# Altium project steam_dev_kit.PrjPcb
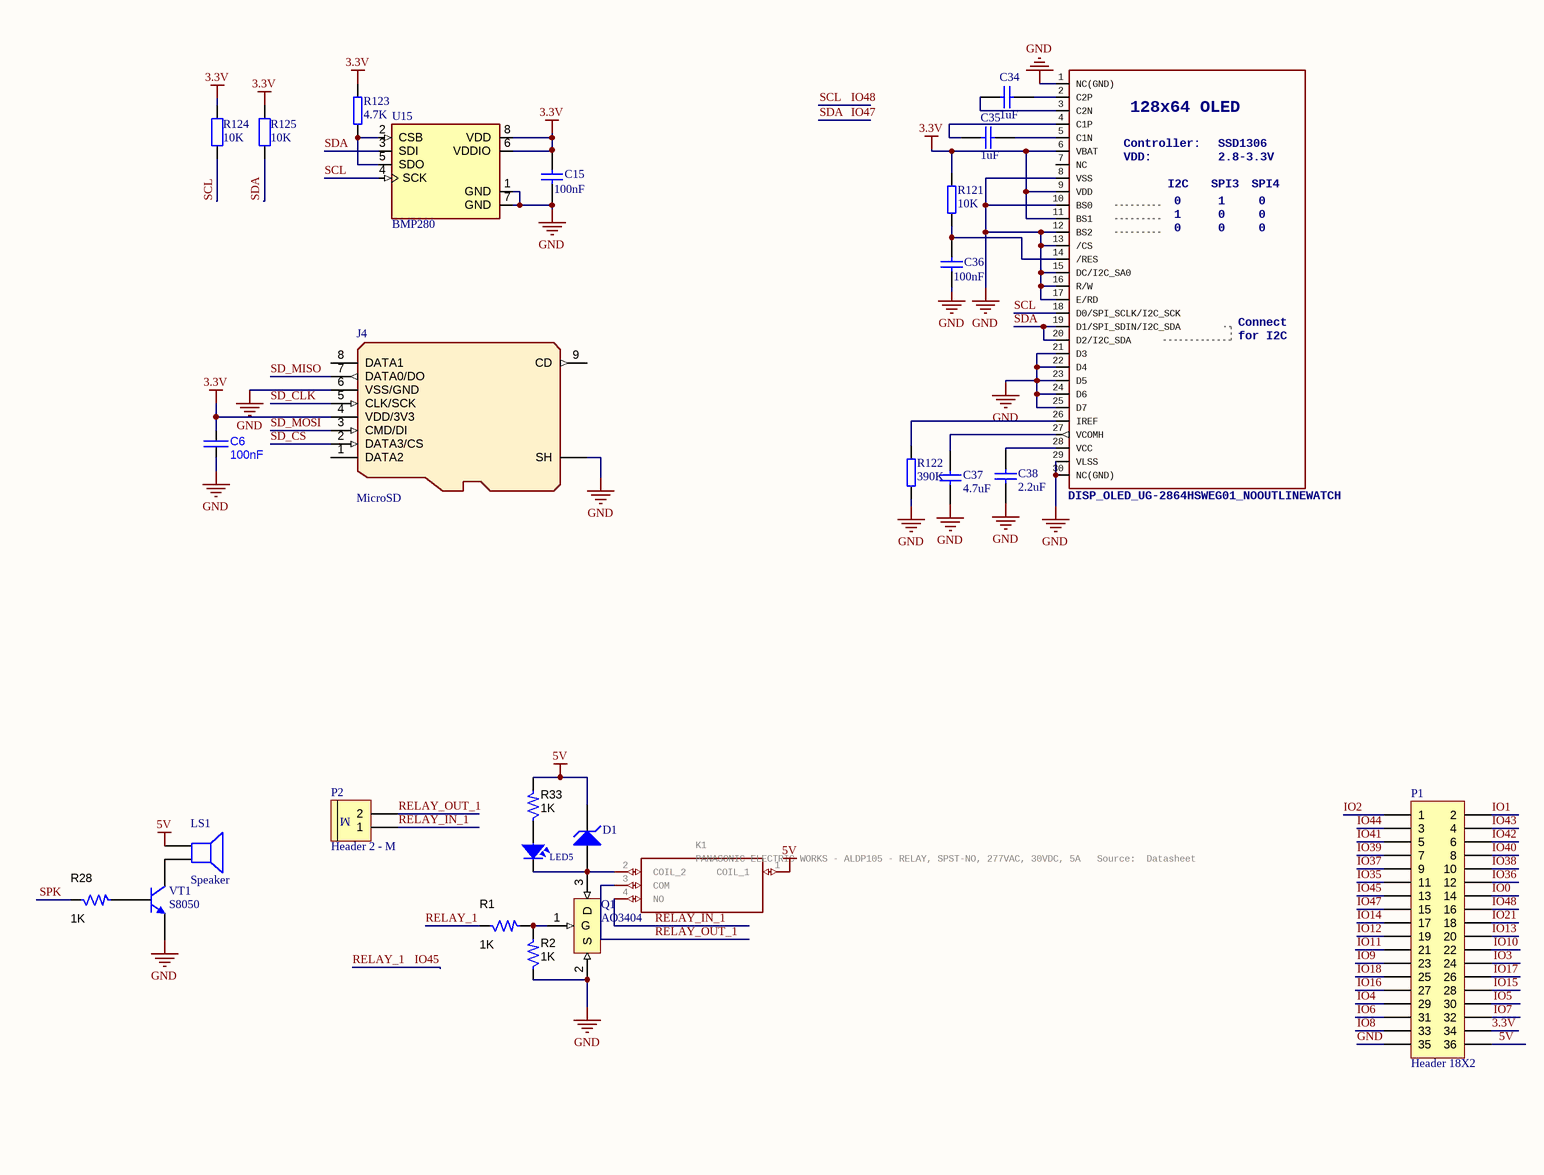
[diagram p0: Other_funtions.SchDoc, left]
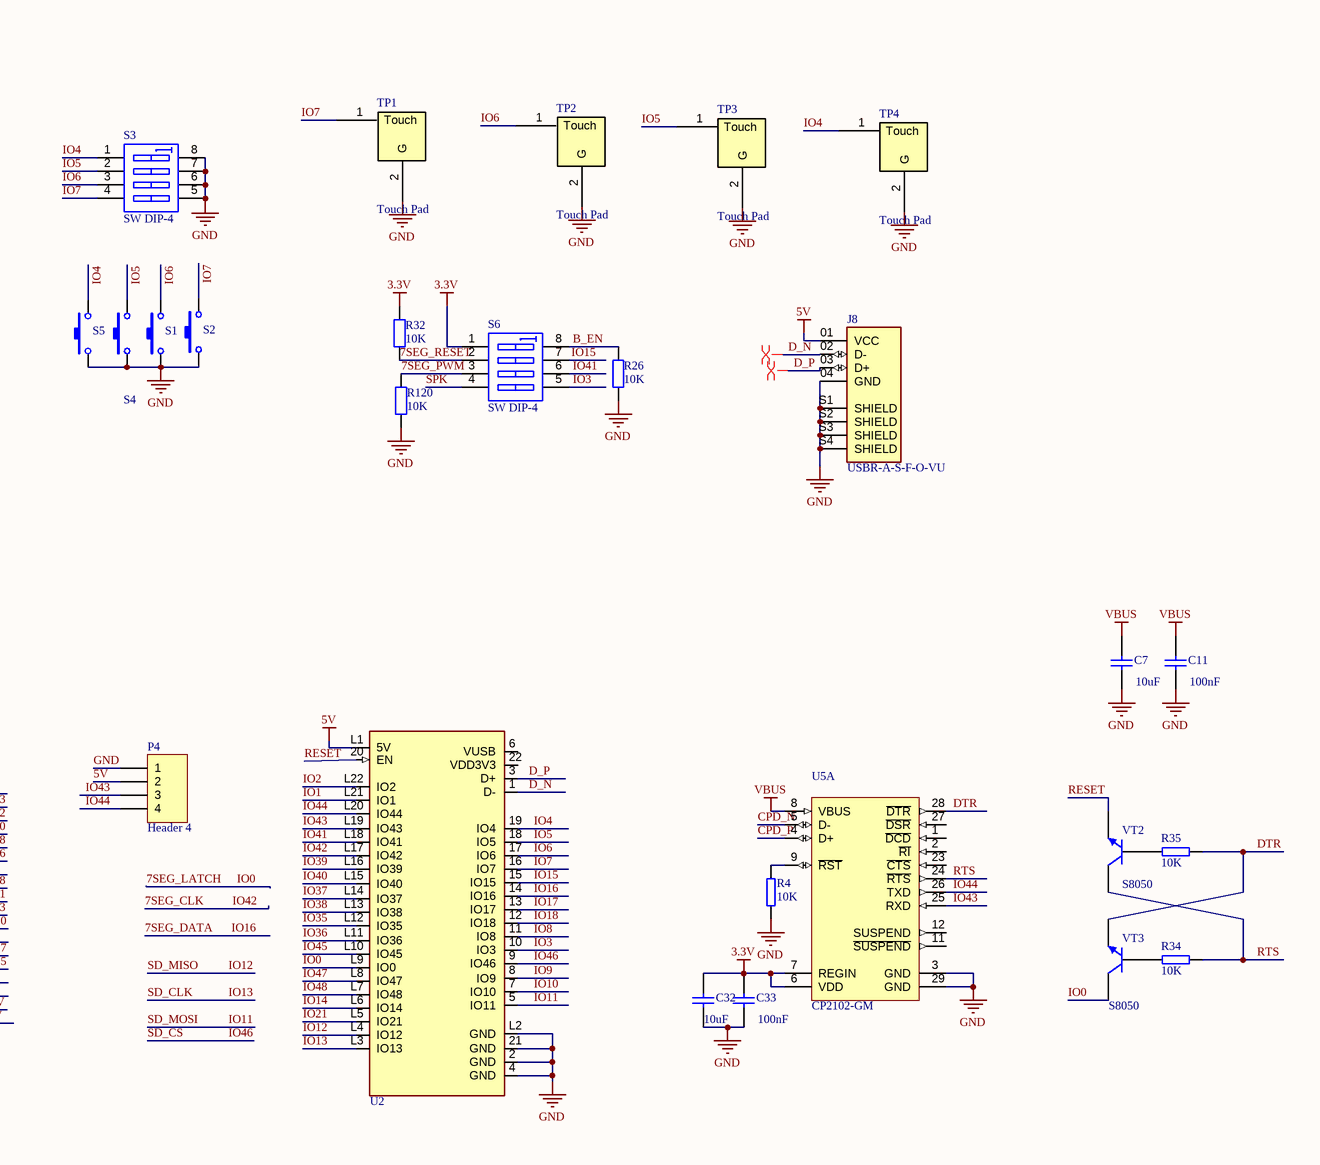
[diagram p1: Other_funtions.SchDoc, right]
5 sheets, 218 parts. Net scope: global (net labels, ports and power ports of the same name join across sheets).
Board file: Steam_dev_kit_revised.PcbDoc
Sheets:
  Other_funtions.SchDoc
  VGA.SchDoc
  ethernet.SchDoc
  POWER_SCH.SchDoc
  LEDS_DISP.SchDoc

## Sheet Other_funtions.SchDoc
size 594 x 420 mm

### Parts
C6  value 100nF  [CAPC2012X135N]  (hidden comment: approved sub OK)
C7  value 10uF  [CAPC1608X90N]  (hidden comment: Cap Semi)
C11  value 100nF  [CAPC1608X90N]  (hidden comment: Cap Semi)
C15  value 100nF  [CAPC1608X90N]  (hidden comment: Cap Semi)
C32  value 10uF  [CAPC1608X90N]  (hidden comment: Cap Semi)
C33  value 100nF  [CAPC1608X90N]  (hidden comment: Cap Semi)
C34  value 1uF  [CAPC1608X90N]  (hidden comment: Cap Semi)
C35  value 1uF  [CAPC1608X90N]  (hidden comment: Cap Semi)
C36  value 100nF  [CAPC1608X90N]  (hidden comment: Cap Semi)
C37  value 4.7uF  [CAPC1608X90N]  (hidden comment: Cap Semi)
C38  value 2.2uF  [CAPC1608X90N]  (hidden comment: Cap Semi)
D1  Diode Zener  [DIODE/NOM/0.5A]  (value not drawn)
J4  MicroSD  [SDCard_Micro]
J8  USBR-A-S-F-O-VU  [SAMTEC_USBR-A-S-F-O-VU]
K1  PANASONIC ELECTRIC WORKS - ALDP105 - RELAY, SPST-NO, 277VAC, 30VDC, 5A   Source:  Datasheet  [ALDP]
LED5  LED SMD  [SM-LED-0805-Orange]  (value not drawn)
LS1  Speaker  [SPEAKER]
OLED1  DISP_OLED_UG-2864HSWEG01_NOOUTLINEWATCH  128x64OLED: 128x64 OLED  forI2C: for I2C  Controller: Controller:  VDD: VDD:  [UG-2864HSWEG01_1.3]
P1  Header 18X2  [HDR2X18]
P2  Header 2 - M  [Medium - Header 2]
P4  Header 4  [HDR1X4]
Q1  AO3404  [SOT23-3]
R1  1K  [RESC1608N_ZERO]
R2  1K  [RESC1608N_ZERO]
R4  value 10K  [RESC1608N_ZERO]  (hidden comment: Resistor)
R26  value 10K  [RES-0603]  (hidden comment: Res2)
R28  1K  [RESC1608N_ZERO]
R32  value 10K  [RES-0603]  (hidden comment: Res2)
R33  1K  [RESC1608N_ZERO]
R34  value 10K  [RESC1608N_ZERO]  (hidden comment: Resistor)
R35  value 10K  [RESC1608N_ZERO]  (hidden comment: Resistor)
R120  value 10K  [RES-0603]  (hidden comment: Res2)
R121  value 10K  [RESC1608N_ZERO]  (hidden comment: Resistor)
R122  value 390K  [RESC1608N_ZERO]  (hidden comment: Resistor)
R123  value 4.7K  [RESC1608N_ZERO]  (hidden comment: Resistor)
R124  value 10K  [RES-0603]  (hidden comment: Res2)
R125  value 10K  [RES-0603]  (hidden comment: Res2)
S1  SW-SMD  [SW-SMD]  (value not drawn)
S2  SW-SMD  [SW-SMD]  (value not drawn)
S3  SW DIP-4  [DIPSWITCH4]
S4  SW-SMD  [SW-SMD]  (value not drawn)
S5  SW-SMD  [SW-SMD]  (value not drawn)
S6  SW DIP-4  [DIPSWITCH4]
TP1  Touch Pad  [Touch Pad]
TP2  Touch Pad  [Touch Pad]
TP3  Touch Pad  [Touch Pad]
TP4  Touch Pad  [Touch Pad]
U2  ESP32S3_CONTROLLER  [ESP32S3_controller]  (value not drawn)
U5  CP2102-GM  [CP2102]  (part A of 2)
U15  BMP280  [XDCR_BMP280]
VT1  S8050  [SMT_TRIODE_NPN]
VT2  S8050  [SMT_TRIODE_NPN]
VT3  S8050  [SMT_TRIODE_NPN]

### Nets
3.3V: C6.2 C15.2 C32.2 C33.2 J4.4(VDD/3V3) OLED1.6(VBAT) OLED1.9(VDD) OLED1.11(BS1) P1.34 R32.1 R121.1 R123.2 R124.1 R125.1 S6.1(A1) U5.6(VDD) U5.7(REGIN) U15.6(VDDIO) U15.8(VDD)
5V: D1.2(K) J8.01(VCC) K1.1(COIL_1) LS1.1 P1.36 P4.2 R33.2 U2.L1(5V)
GND: C6.1 C7.1 C11.1 C15.1 C32.1 C33.1 C36.1 C37.2 C38.2 J4.6(VSS/GND) J4.SH J8.04(GND) J8.S1(SHIELD) J8.S2(SHIELD) J8.S3(SHIELD) J8.S4(SHIELD) OLED1.1(NC(GND)) OLED1.8(VSS) OLED1.10(BS0) OLED1.12(BS2) OLED1.13(/CS) OLED1.15(DC/I2C_SA0) OLED1.16(R/W) OLED1.17(E/RD) OLED1.21(D3) OLED1.22(D4) OLED1.23(D5) OLED1.24(D6) OLED1.25(D7) OLED1.29(VLSS) OLED1.30(NC(GND)) P1.35 P4.1 Q1.2(S) R2.1 R4.2 R26.2 R120.2 R122.2 S1.1 S2.1 S3.5(B4) S3.6(B3) S3.7(B2) S3.8(B1) S4.1 S5.1 TP1.2(G) TP2.2(G) TP3.2(G) TP4.2(G) U2.2(GND) U2.4(GND) U2.21(GND) U2.L2(GND) U5.3(GND) U5.29(GND) U15.1(GND) U15.7(GND) VT1.2(E)
VBUS: C7.2 C11.2 U5.8(VBUS)
7SEG_CLK: P1.6 U2.L17(IO42)  [also labelled IO42]
7SEG_DATA: P1.27 U2.14(IO16)  [also labelled IO16]
7SEG_LATCH: P1.14 U2.L9(IO0) VT3.3(C)  [also labelled IO0]
7SEG_PWM: R120.1 S6.3(A3)
7SEG_RESET: R32.2 S6.2(A2)
B_EN: R26.1 S6.8(B1)
CPD_N: U5.5(D-)
CPD_P: U5.4(D+)
D_N: J8.02(D-) U2.1(D-)
D_P: J8.03(D+) U2.3(D+)
DTR: R35.2 U5.28(~{DTR}) VT3.2(E)
IO1: P1.2 U2.L21(IO1)
IO2: P1.1 U2.L22(IO2)
IO3: P1.24 S6.5(B4) U2.10(IO3)
IO4: P1.29 S3.1(A1) S5.2 TP4.1(Touch) U2.19(IO4)
IO5: P1.30 S3.2(A2) S4.2 TP3.1(Touch) U2.18(IO5)
IO6: P1.31 S1.2 S3.3(A3) TP2.1(Touch) U2.17(IO6)
IO7: P1.32 S2.2 S3.4(A4) TP1.1(Touch) U2.16(IO7)
IO8: P1.33 U2.11(IO8)
IO9: P1.23 U2.8(IO9)
IO10: P1.22 U2.7(IO10)
IO11: J4.3(CMD/DI) P1.21 U2.5(IO11)  [also labelled SD_MOSI]
IO12: J4.7(DATA0/DO) P1.19 U2.L4(IO12)  [also labelled SD_MISO]
IO13: J4.5(CLK/SCK) P1.20 U2.L3(IO13)  [also labelled SD_CLK]
IO14: P1.17 U2.L6(IO14)
IO15: P1.28 S6.7(B2) U2.15(IO15)
IO17: P1.26 U2.13(IO17)
IO18: P1.25 U2.12(IO18)
IO21: P1.18 U2.L5(IO21)
IO35: P1.11 U2.L12(IO35)
IO36: P1.12 U2.L11(IO36)
IO37: P1.9 U2.L14(IO37)
IO38: P1.10 U2.L13(IO38)
IO39: P1.7 U2.L16(IO39)
IO40: P1.8 U2.L15(IO40)
IO41: P1.5 S6.6(B3) U2.L18(IO41)
IO43: P1.4 P4.3 U2.L19(IO43) U5.25(RXD)
IO44: P1.3 P4.4 U2.L20(IO44) U5.26(TXD)
IO45: P1.13 R1.1 U2.L10(IO45)  [also labelled RELAY_1]
IO46: J4.2(DATA3/CS) U2.9(IO46)  [also labelled SD_CS]
IO47: OLED1.19(D1/SPI_SDIN/I2C_SDA) OLED1.20(D2/I2C_SDA) P1.15 R125.2 U2.L8(IO47) U15.3(SDI)  [also labelled SDA]
IO48: OLED1.18(D0/SPI_SCLK/I2C_SCK) P1.16 R124.2 U2.L7(IO48) U15.4(SCK)  [also labelled SCL]
RELAY_IN_1: K1.4(NO) P2.1
RELAY_OUT_1: K1.3(COM) P2.2
RESET: U2.20(EN) VT2.2(E)
RTS: R34.1 U5.24(~{RTS}) VT2.3(C)
SPK: R28.1 S6.4(A4)
NetC34_1: C34.1 OLED1.2(C2P)
NetC34_2: C34.2 OLED1.3(C2N)
NetC35_1: C35.1 OLED1.5(C1N)
NetC35_2: C35.2 OLED1.4(C1P)
NetC36_2: C36.2 OLED1.14(/RES) R121.2
NetC37_1: C37.1 OLED1.27(VCOMH)
NetC38_1: C38.1 OLED1.28(VCC)
NetD1_1: D1.1(A) K1.2(COIL_2) LED5.2 Q1.3(D)
NetLED5_1: LED5.1 R33.1
NetLS1_2: LS1.2 VT1.3(C)
NetOLED1_26: OLED1.26(IREF) R122.1
NetQ1_1: Q1.1(G) R1.2 R2.2
NetR4_1: R4.1 U5.9(~{RST})
NetR28_2: R28.2 VT1.1(B)
NetR34_2: R34.2 VT3.1(B)
NetR35_1: R35.1 VT2.1(B)
NetR123_1: R123.1 U15.2(CSB) U15.5(SDO)

Not connected (* = marked no-connect by the designer): J4 1(DATA2) 8(DATA1) 9(CD); OLED1 7(NC); U2 6(VUSB) 22(VDD3V3); U5 1(~{DCD}) 2(~{RI}) 11(~{SUSPEND}) 12(SUSPEND) 23(~{CTS}) 27(~{DSR})

### Layout directives
differential pair: D_N, D_P

### Notes on the sheet
- DWG NO:
- REV:
- THIS DOCUMENT AND THE DATA DISCLOSED HEREIN OR
- HEREWITH IS THE PROPERTY OF ALTIUM LIMITED AND MAY
- BE FREELY DISTRIBUTED IN WHOLE. NO RIGHTS ARE
- RESERVED OR EXPRESS OR IMPLIED WARANTEE GIVEN.
- REVISION
- DESCRIPTION
- DATE
- APPROVED
- ENG:
- APPROVALS
- PROJECT
- DSN:
- CHK:
- REFERENCE DOCUMENTS
- PROJECT REVISION:
- TITLE
- DOCUMENT REVISION:
- DESIGN ITEM:
- BOM:
- FAB DWG:
- PCB DWG:
- ASSY DWG:
- SCALE:
- A2
- SIZE
- CAGE CODE
- FILE NAME
- DWG NO.
- SHEET
- OF
- REV
- (in symbol Header 2 - M) M

### Library data of the parts
C6 = CAP C_0805: Capacitor SMD Cer 1.8nF 10% 50V X7R 0805; Manufacturer 1: AVX Corporation; Manufacturer Part Number 1: 08055C182KAT2A; Ratings: 50V; X7R; SCDType: source*; Tolerance: ±10%; Operating Temperature: -55°C ~ 125°C; Package / Case: 0805 (2012 metric); Supplier 1: Digi-Key; Supplier Part Number 1: 478-1374-1-ND
C7 C32 = CAP-SM-0603-X5R-10uF: CAP SM 0603 X5R 10uF 10%; Tolerance: ±10%; Supplier 1: Farnell; Supplier 2: Digi-Key; Supplier Part Number 1: 2366833; Supplier Part Number 2: 490-3896-1-ND
C11 C15 C33-C38 = CAP-SM-0603-X7R-100nF: CAP SM 0603 X7R 100nF 10%; Tolerance: ±10%; Supplier 1: Digi-Key; Supplier 2: Farnell; Supplier Part Number 1: 490-3167-1-ND; Supplier Part Number 2: 1775994RL
D1 = Diode Zener: Zener Diode; Published: 8-Jun-2000; LatestRevisionDate: 17-Jul-2002; LatestRevisionNote: Re-released for DXP Platform.; PackageReference: DIODE-0.7; Publisher: Altium Limited
J4 = MicroSD: Micro SD Memory Card Connector; Value: MicroSD
J8 = USBR-A-S-F-O-VU: USB-A (USB TYPE-A) USB 2.0 Receptacle Connector 4 Position Through Hole; MF: Samtec; SnapEDA_Link: https://www.snapeda.com/parts/USBR-A-S-F-O-VU/Samtec+Inc./view-part/?ref=snap; Package: None; Value: *; MP: USBR-A-S-F-O-VU; Check_prices: https://www.snapeda.com/parts/USBR-A-S-F-O-VU/Samtec+Inc./view-part/?ref=eda
K1 = ALDP105: GateName_1: G$1; SymbolName_1: ALDP105; LibraryName: ALDP105; DeviceSetName: ALDP105; Package: ALDP; Manufacturer_Name: Panasonic; Manufacturer_Part_Number: ALDP105; Mouser_Part_Number: 769-ALDP105; Mouser_Price-Stock: https://www.mouser.co.uk/ProductDetail/Panasonic-Industrial-Devices/ALDP105?qs=Xhpf1s68vbq5B68QcwMLFg%3D%3D; Arrow_Part_Number: ALDP105; Arrow_Price-Stock: https://www.arrow.com/en/products/aldp105/panasonic; Height: mm
LED5 = LED SMD 0805
LS1 = Speaker: Loudspeaker; Published: 24-Mar-1999; LatestRevisionDate: 17-Jul-2002; LatestRevisionNote: Re-released for DXP Platform.; PackageReference: PIN2; Publisher: Altium Limited
P1 = Header 18X2: Header, 18-Pin, Dual row; LatestRevisionDate: 17-Jul-2002; LatestRevisionNote: Re-released for DXP Platform.; Publisher: Altium Limited
P2 = Header 2 - M: Header, 2-Pin, Medium; LatestRevisionDate: 17-Jul-2002; LatestRevisionNote: Re-released for DXP Platform.; Publisher: Altium Limited
P4 = Header 4: Header, 4-Pin; LatestRevisionDate: 17-Jul-2002; LatestRevisionNote: Re-released for DXP Platform.; Publisher: Altium Limited
R1 R2 R28 R33 = RES_0603: Resistor SMD chip 0.0 Ohm 0.1W 0603; Manufacturer 1: Vishay/Dale; Manufacturer Part Number 1: CRCW06030000Z0EA; Tolerance: ±5%; Ratings: 1/10W; SCDType: spec; Package / Case: 0603 (1608metric); Supplier 1: Digi-Key; Supplier Part Number 1: 541-0.0GCT-ND; ComponentLink1URL: http://www.vishay.com/doc?20035; ComponentLink1Description: http://www.vishay.com/doc?20035; Supplier 2: Digi-Key; Supplier Part Number 2: P0.0GTR-ND; Manufacturer 2: Panasonic Electronic Components; Manufacturer Part Number 2: ERJ-3GEY0R00V; RoHS 2: RoHS Compliant; ComponentLink2URL: http://industrial.panasonic.com/www-cgi/jvcr13pz.cgi?E+PZ+3+AOA0001+ERJ3GEY0R00V+7+WW; ComponentLink2Description: http://industrial.panasonic.com/www-cgi/jvcr13pz.cgi?E+PZ+3+AOA0001+ERJ3GEY0R00V+7+WW; Supplier 3: Digi-Key; Supplier Part Number 3: 311-0.0LECT-ND; Manufacturer 3: Yageo; Manufacturer Part Number 3: AC0603JR-070RL; RoHS 3: RoHS Compliant; ComponentLink3URL: http://www.yageo.com/documents/recent/PYu-AC_51_RoHS_L_2.pdf; ComponentLink3Description: http://www.yageo.com/documents/recent/PYu-AC_51_RoHS_L_2.pdf
R4 R34 R35 R121-R123 = RES-SM-0603-10K: RES SM 0603 10K; Supplier 1: Farnell; Supplier 2: Digi-Key; Supplier Part Number 1: 9330399; Supplier Part Number 2: 541-10.0KHCT-ND
R26 R32 R120 R124 R125 = Res2: Resistor; Published: 8-Jun-2000; LatestRevisionDate: 17-Jul-2002; LatestRevisionNote: Re-released for DXP Platform.; PackageReference: AXIAL-0.4; Publisher: Altium Limited; PackageDescription: Axial Device, Thru-Hole; 2 Leads; 0.4 in Pin Spacing
S1 S2 S4 S5 = SW-SMD: Switch; Published: 24-Mar-1999; LatestRevisionDate: 17-Jul-2002; LatestRevisionNote: Re-released for DXP Platform.; PackageReference: SPST-2; Publisher: Altium Limited
S3 S6 = SW DIP-4: DIP Switch, 4 Position, SPST; Published: 24-Mar-1999; LatestRevisionDate: 29-May-2009; LatestRevisionNote: IPC-7351 Footprint Added.; PackageVersion: Dec-2002; PackageReference: SO8; Publisher: Altium Limited; PackageDescription: 8-Pin Small Outline Integrated Circuit 1.27 mm Pitch; Code_JEDEC: MS-012-AA; Code_IPC: SOIC127P600-8
U5 = CP2102-GM: Single-Chip USB to UART Bridge, 1024 Bytes EEPROM, -40 to 85 degC, 28-pin QFN, Tube; Manufacturer: Silicon Labs; Internal Oscillator: TRUE; Sub-Family: USB Bridges; DatasheetVersion: Rev. 1.5; PackageReference: QFN-28; PackageDescription: 28-Pin Quad-Flat No-Leads Package, Body 5 x 5 mm, Pitch 0.5 mm; Supplier 1: Digi-Key; Supplier Part Number 1: 336-1160-5-ND; Supplier 2: Farnell; Supplier Part Number 2: 9282130; Supplier 3: Newark; Supplier Part Number 3: 30K5635; Supplier 4: Mouser; Supplier Part Number 4: 634-CP2102-GM; EEPROM: 1024 Bytes; Mounting Technology: Surface Mount; Code_JEDEC: MO-220; Code_IPC: J-STD-020C; PartNumber: CP2102-GM; ComponentLink1Description: Manufacturer URL; ComponentLink1URL: http://www.silabs.com/; ComponentLink2Description: Datasheet; ComponentLink2URL: http://www.silabs.com/Support%20Documents/TechnicalDocs/CP2102-9.pdf; ComponentLink3Description: Package Specification; ComponentLink3URL: http://www.silabs.com/Support%20Documents/TechnicalDocs/C8051T61x.pdf
U15 = BMP280: BMP280 Absolute Barometric Pressure Sensor for Battery Powered Devices 2 x 2.5mm; Package: None; Availability: Unavailable; MP: BMP280; Value: *; Price: None
VT1-VT3 = SMT_TRIODE_NPN: Surface mount NPN transistor, package SOT-23
OLED1 = DISP_OLED_UG-2864HSWEG01_NOOUTLINEWATCH: I2C: I2C; SPI3: SPI3; 0: 0; 1: 1; Connect: Connect; SSD1306: SSD1306; 2.8-3.3V: 2.8-3.3V; SPI4: SPI4

## Sheet VGA.SchDoc
size 431 x 279 mm
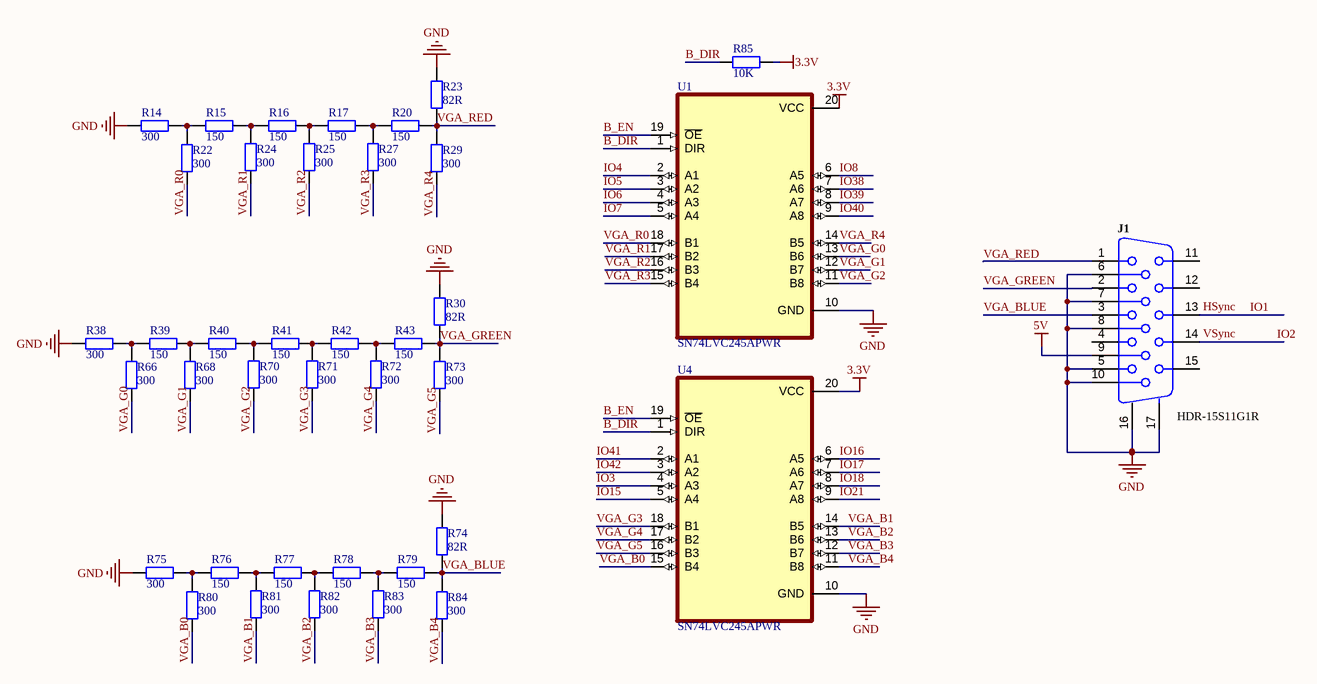
[diagram p2: VGA.SchDoc]

### Parts
J1  HDR-15S11G1R  [DB15-VGA-Female]
R14  value 300  [RES-0603]  (hidden comment: Res2)
R15  value 150  [RES-0603]  (hidden comment: Res2)
R16  value 150  [RES-0603]  (hidden comment: Res2)
R17  value 150  [RES-0603]  (hidden comment: Res2)
R20  value 150  [RES-0603]  (hidden comment: Res2)
R22  value 300  [RES-0603]  (hidden comment: Res2)
R23  value 82R  [RES-0603]  (hidden comment: Res2)
R24  value 300  [RES-0603]  (hidden comment: Res2)
R25  value 300  [RES-0603]  (hidden comment: Res2)
R27  value 300  [RES-0603]  (hidden comment: Res2)
R29  value 300  [RES-0603]  (hidden comment: Res2)
R30  value 82R  [RES-0603]  (hidden comment: Res2)
R38  value 300  [RES-0603]  (hidden comment: Res2)
R39  value 150  [RES-0603]  (hidden comment: Res2)
R40  value 150  [RES-0603]  (hidden comment: Res2)
R41  value 150  [RES-0603]  (hidden comment: Res2)
R42  value 150  [RES-0603]  (hidden comment: Res2)
R43  value 150  [RES-0603]  (hidden comment: Res2)
R66  value 300  [RES-0603]  (hidden comment: Res2)
R68  value 300  [RES-0603]  (hidden comment: Res2)
R70  value 300  [RES-0603]  (hidden comment: Res2)
R71  value 300  [RES-0603]  (hidden comment: Res2)
R72  value 300  [RES-0603]  (hidden comment: Res2)
R73  value 300  [RES-0603]  (hidden comment: Res2)
R74  value 82R  [RES-0603]  (hidden comment: Res2)
R75  value 300  [RES-0603]  (hidden comment: Res2)
R76  value 150  [RES-0603]  (hidden comment: Res2)
R77  value 150  [RES-0603]  (hidden comment: Res2)
R78  value 150  [RES-0603]  (hidden comment: Res2)
R79  value 150  [RES-0603]  (hidden comment: Res2)
R80  value 300  [RES-0603]  (hidden comment: Res2)
R81  value 300  [RES-0603]  (hidden comment: Res2)
R82  value 300  [RES-0603]  (hidden comment: Res2)
R83  value 300  [RES-0603]  (hidden comment: Res2)
R84  value 300  [RES-0603]  (hidden comment: Res2)
R85  value 10K  [RES-0603]  (hidden comment: Res2)
U1  SN74LVC245APWR  [SOP65P640X120-20N]
U4  SN74LVC245APWR  [SOP65P640X120-20N]

### Nets
3.3V: R85.1 U1.20(VCC) U4.20(VCC)
5V: J1.9
GND: J1.5 J1.6 J1.7 J1.8 J1.10 J1.16(MH1) J1.17(MH2) R14.2 R23.2 R30.2 R38.2 R74.2 R75.2 U1.10(GND) U4.10(GND)
B_DIR: R85.2 U1.1(DIR) U4.1(DIR)
B_EN: U1.19(~{OE}) U4.19(~{OE})
IO1: J1.13
IO2: J1.14
IO3: U4.4(A3)
IO4: U1.2(A1)
IO5: U1.3(A2)
IO6: U1.4(A3)
IO7: U1.5(A4)
IO8: U1.6(A5)
IO15: U4.5(A4)
IO16: U4.6(A5)  [project net 7SEG_DATA]
IO17: U4.7(A6)
IO18: U4.8(A7)
IO21: U4.9(A8)
IO38: U1.7(A6)
IO39: U1.8(A7)
IO40: U1.9(A8)
IO41: U4.2(A1)
IO42: U4.3(A2)  [project net 7SEG_CLK]
VGA_B0: R80.2 U4.15(B4)
VGA_B1: R81.2 U4.14(B5)
VGA_B2: R82.2 U4.13(B6)
VGA_B3: R83.2 U4.12(B7)
VGA_B4: R84.2 U4.11(B8)
VGA_BLUE: J1.3 R74.1 R79.1 R84.1
VGA_G0: R66.2 U1.13(B6)
VGA_G1: R68.2 U1.12(B7)
VGA_G2: R70.2 U1.11(B8)
VGA_G3: R71.2 U4.18(B1)
VGA_G4: R72.2 U4.17(B2)
VGA_G5: R73.2 U4.16(B3)
VGA_GREEN: J1.2 R30.1 R43.1 R73.1
VGA_R0: R22.2 U1.18(B1)
VGA_R1: R24.2 U1.17(B2)
VGA_R2: R25.2 U1.16(B3)
VGA_R3: R27.2 U1.15(B4)
VGA_R4: R29.2 U1.14(B5)
VGA_RED: J1.1 R20.1 R23.1 R29.1
NetR14_1: R14.1 R15.2 R22.1
NetR15_1: R15.1 R16.2 R24.1
NetR16_1: R16.1 R17.2 R25.1
NetR17_1: R17.1 R20.2 R27.1
NetR38_1: R38.1 R39.2 R66.1
NetR39_1: R39.1 R40.2 R68.1
NetR40_1: R40.1 R41.2 R70.1
NetR41_1: R41.1 R42.2 R71.1
NetR42_1: R42.1 R43.2 R72.1
NetR75_1: R75.1 R76.2 R80.1
NetR76_1: R76.1 R77.2 R81.1
NetR77_1: R77.1 R78.2 R82.1
NetR78_1: R78.1 R79.2 R83.1

Not connected (* = marked no-connect by the designer): J1 4 11 12 15

### Notes on the sheet
- Labels drawn without touching a wire or pin: HSync, VSync
- DWG. NO.
- REV.
- SHT.
- THIS DOCUMENT AND THE DATA DISCLOSED HEREIN OR HEREWITH IS THE PROPERTY OF ALTIUM LIMITED AND MAY BE FREELY DISTRIBUTED IN WHOLE. NO RIGHTS ARE RESERVED OR EXPRESS OR IMPLIED WARANTEE GIVEN.
- REVISION
- DESCRIPTION
- DATE
- APPROVED
- ENG:
- APPROVALS
- PROJECT
- DSN:
- CHK:
- REFERENCE DOCUMENTS
- PROJECT REVISION:
- TITLE
- DOCUMENT REVISION:
- DESIGN ITEM:
- BOM:
- FAB DWG:
- PCB DWG:
- ASSY DWG:
- SCALE:
- SIZE
- B
- CAGE CODE
- FILE NAME
- DWG NO.
- SHEET
- OF
- REV

### Library data of the parts
J1 = CON 15 Female: Socket, High-Density DB15 (HD15) R/A Female Through-hole; Connector type: Right Angle; Max Current: 3 A; Category: Connector; Mounting Technology: Through-Hole; Pin Count: 15; Status: Unreleased
R14-R17 R20 R22-R25 R27 R29 R30 R38-R43 R66 R68 R70-R85 = Res2: Resistor; Published: 8-Jun-2000; LatestRevisionDate: 17-Jul-2002; LatestRevisionNote: Re-released for DXP Platform.; PackageReference: AXIAL-0.4; Publisher: Altium Limited; PackageDescription: Axial Device, Thru-Hole; 2 Leads; 0.4 in Pin Spacing
U1 U4 = SN74LVC245APWR: Octal Bus Transceiver With 3-State Outputs 20-TSSOP -40 to 125; MF: Texas Instruments; Check_prices: https://www.snapeda.com/parts/SN74LVC245APWR/Texas%20Instruments/view-part/213920/?ref=eda; Package: TSSOP-20 Texas Instruments; MP: SN74LVC245APWR; Purchase-URL: https://pricing.snapeda.com/search/part/SN74LVC245APWR/?ref=eda; SnapEDA_Link: https://www.snapeda.com/parts/SN74LVC245APWR/Texas%20Instruments/view-part/213920/?ref=snap; Value: *; Price: None; Availability: Good

## Sheet ethernet.SchDoc
size 431 x 279 mm
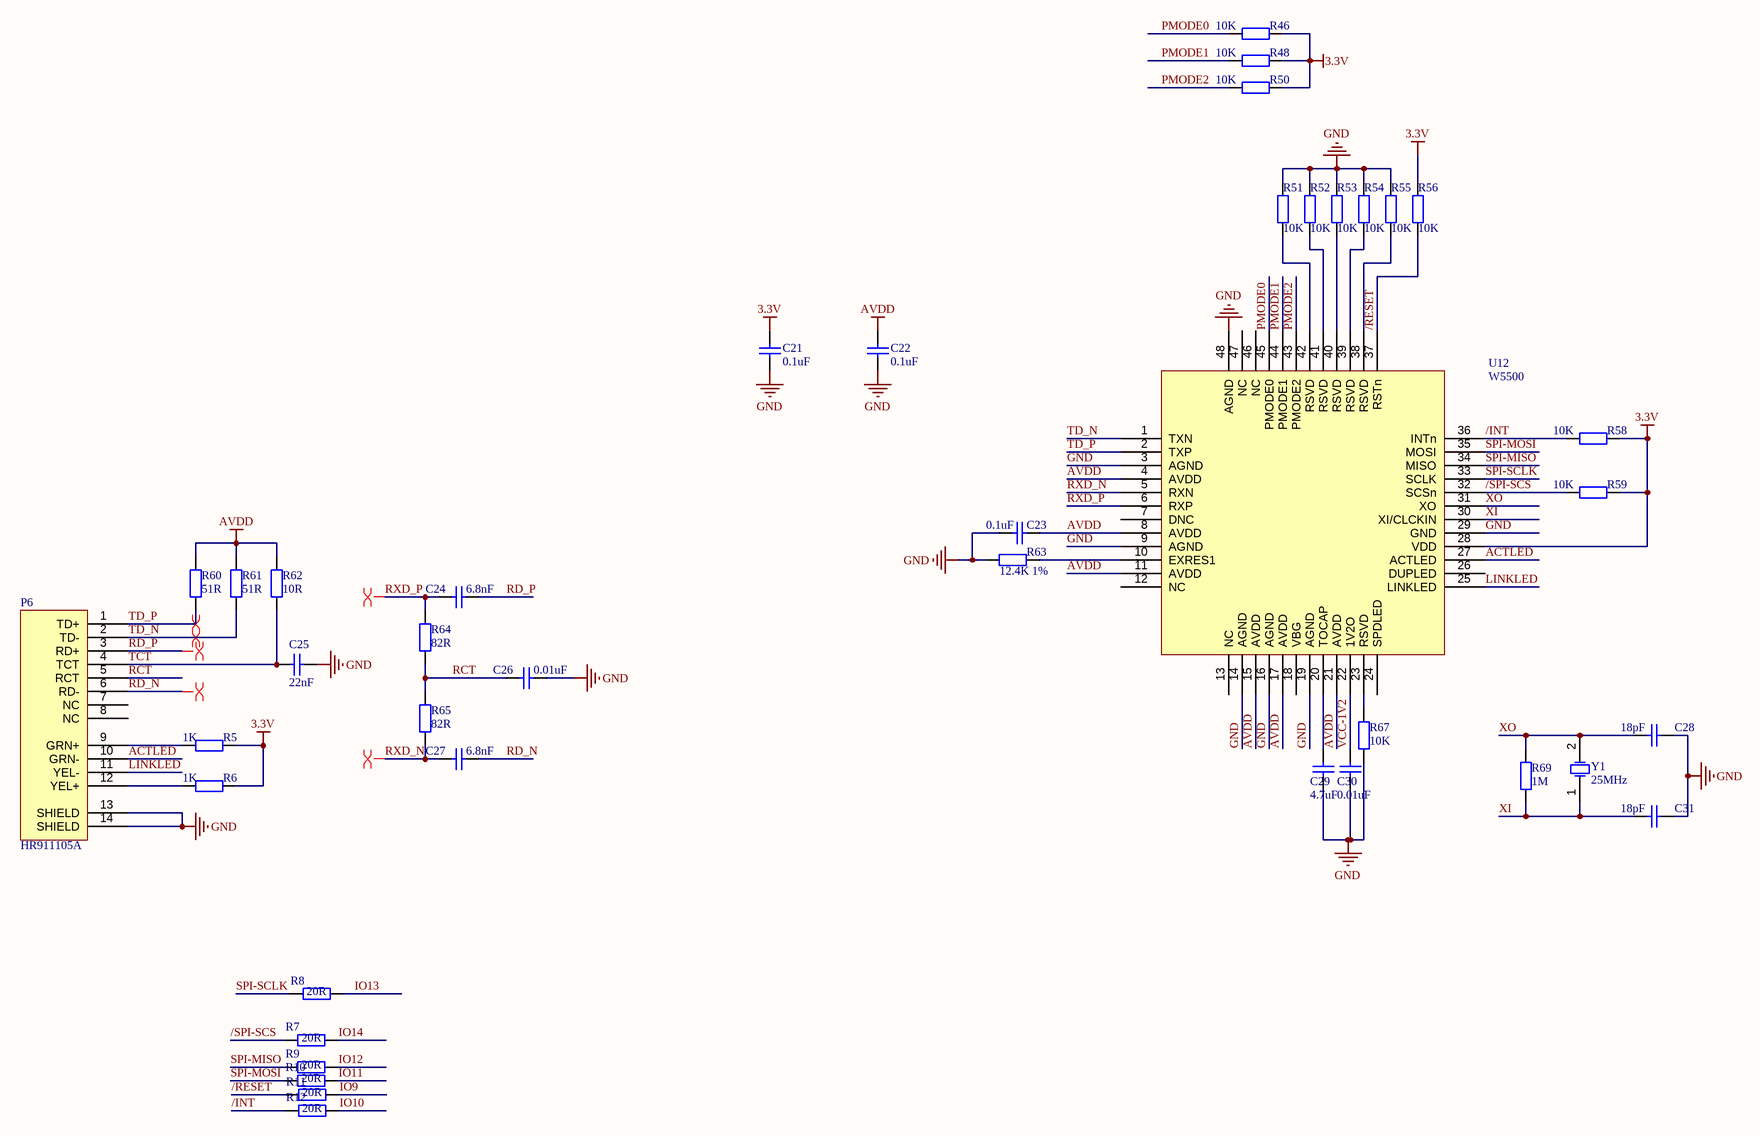
[diagram p3: ethernet.SchDoc]

### Parts
C21  value 0.1uF  [C0805]  (hidden comment: Cap)
C22  value 0.1uF  [C0805]  (hidden comment: Cap)
C23  value 0.1uF  [C0805]  (hidden comment: Cap)
C24  value 6.8nF  [C0805]  (hidden comment: Cap)
C25  value 22nF  [C0805]  (hidden comment: Cap)
C26  value 0.01uF  [C0805]  (hidden comment: Cap)
C27  value 6.8nF  [C0805]  (hidden comment: Cap)
C28  value 18pF  [C0805]  (hidden comment: Cap)
C29  value 4.7uF  [C0805]  (hidden comment: Cap)
C30  value 0.01uF  [C0805]  (hidden comment: Cap)
C31  value 18pF  [C0805]  (hidden comment: Cap)
P6  HR911105A  [HR911105A]
R5  value 1K  [C0805]  (hidden comment: Res2)
R6  value 1K  [C0805]  (hidden comment: Res2)
R7  value 20R  [C0805]  (hidden comment: Res2)
R8  value 20R  [C0805]  (hidden comment: Res2)
R9  value 20R  [C0805]  (hidden comment: Res2)
R10  value 20R  [C0805]  (hidden comment: Res2)
R11  value 20R  [C0805]  (hidden comment: Res2)
R12  value 20R  [C0805]  (hidden comment: Res2)
R46  value 10K  [C0805]  (hidden comment: Res2)
R48  value 10K  [C0805]  (hidden comment: Res2)
R50  value 10K  [C0805]  (hidden comment: Res2)
R51  value 10K  [C0805]  (hidden comment: Res2)
R52  value 10K  [C0805]  (hidden comment: Res2)
R53  value 10K  [C0805]  (hidden comment: Res2)
R54  value 10K  [C0805]  (hidden comment: Res2)
R55  value 10K  [C0805]  (hidden comment: Res2)
R56  value 10K  [C0805]  (hidden comment: Res2)
R58  value 10K  [C0805]  (hidden comment: Res2)
R59  value 10K  [C0805]  (hidden comment: Res2)
R60  value 51R  [C0805]  (hidden comment: Res2)
R61  value 51R  [C0805]  (hidden comment: Res2)
R62  value 10R  [C0805]  (hidden comment: Res2)
R63  value 12.4K 1%  [C0805]  (hidden comment: Res2)
R64  value 82R  [C0805]  (hidden comment: Res2)
R65  value 82R  [C0805]  (hidden comment: Res2)
R67  value 10K  [C0805]  (hidden comment: Res2)
R69  value 1M  [C0805]  (hidden comment: Res2)
U12  W5500  [LQFP48]
Y1  25MHz  [XTAL-HC49]

### Nets
3.3V: C21.1 R5.1 R6.1 R46.2 R48.2 R50.2 R56.2 R58.2 R59.2 U12.28(VDD)
AVDD: C22.2 C23.1 R60.1 R61.1 R62.1 U12.4(AVDD) U12.8(AVDD) U12.11(AVDD) U12.15(AVDD) U12.17(AVDD) U12.21(AVDD)
GND: C21.2 C22.1 C23.2 C25.2 C26.1 C28.1 C29.2 C30.2 C31.1 P6.13(SHIELD) P6.14(SHIELD) R51.2 R52.2 R53.2 R54.2 R55.2 R63.1 R67.1 U12.3(AGND) U12.9(AGND) U12.14(AGND) U12.16(AGND) U12.19(AGND) U12.29(GND) U12.48(AGND)
/INT: R12.2 R58.1 U12.36(INTn)
/RESET: R11.2 R56.1 U12.37(RSTn)
/SPI-SCS: R7.2 R59.1 U12.32(SCSn)
ACTLED: P6.10(GRN-) U12.27(ACTLED)
IO9: R11.1
IO10: R12.1
IO11: R10.1
IO12: R9.1
IO13: R8.1
IO14: R7.1
LINKLED: P6.11(YEL-) U12.25(LINKLED)
PMODE0: R46.1 U12.45(PMODE0)
PMODE1: R48.1 U12.44(PMODE1)
PMODE2: R50.1 U12.43(PMODE2)
RCT: C26.2 P6.5(RCT) R64.1 R65.2
RD_N: C27.1 P6.6(RD-)
RD_P: C24.1 P6.3(RD+)
RXD_N: C27.2 R65.1 U12.5(RXN)
RXD_P: C24.2 R64.2 U12.6(RXP)
SPI-MISO: R9.2 U12.34(MISO)
SPI-MOSI: R10.2 U12.35(MOSI)
SPI-SCLK: R8.2 U12.33(SCLK)
TCT: C25.1 P6.4(TCT) R62.2
TD_N: P6.2(TD-) R61.2 U12.1(TXN)
TD_P: P6.1(TD+) R60.2 U12.2(TXP)
VCC-1V2: C30.1 U12.22(1V2O)
XI: C31.2 R69.1 U12.30(XI/CLCKIN) Y1.1(OSC1)
XO: C28.2 R69.2 U12.31(XO) Y1.2(OSC2)
NetC29_1: C29.1 U12.20(TOCAP)
NetP6_9: P6.9(GRN+) R5.2
NetP6_12: P6.12(YEL+) R6.2
NetR51_1: R51.1 U12.42(RSVD)
NetR52_1: R52.1 U12.41(RSVD)
NetR53_1: R53.1 U12.40(RSVD)
NetR54_1: R54.1 U12.39(RSVD)
NetR55_1: R55.1 U12.38(RSVD)
NetR63_2: R63.2 U12.10(EXRES1)
NetR67_2: R67.2 U12.23(RSVD)

Not connected (* = marked no-connect by the designer): P6 7(NC) 8(NC); U12 7(DNC) 12(NC) 13(NC) 18(VBG) 24(SPDLED) 26(DUPLED) 46(NC) 47(NC)

### Layout directives
differential pair: RD_N, RD_P, RXD_N, RXD_P, TD_N, TD_P

### Notes on the sheet
- DWG. NO.
- REV.
- SHT.
- THIS DOCUMENT AND THE DATA DISCLOSED HEREIN OR HEREWITH IS THE PROPERTY OF ALTIUM LIMITED AND MAY BE FREELY DISTRIBUTED IN WHOLE. NO RIGHTS ARE RESERVED OR EXPRESS OR IMPLIED WARANTEE GIVEN.
- REVISION
- DESCRIPTION
- DATE
- APPROVED
- ENG:
- APPROVALS
- PROJECT
- DSN:
- CHK:
- REFERENCE DOCUMENTS
- PROJECT REVISION:
- TITLE
- DOCUMENT REVISION:
- DESIGN ITEM:
- BOM:
- FAB DWG:
- PCB DWG:
- ASSY DWG:
- SCALE:
- SIZE
- B
- CAGE CODE
- FILE NAME
- DWG NO.
- SHEET
- OF
- REV

### Library data of the parts
C21-C31 = Cap: Capacitor; Published: 8-Jun-2000; LatestRevisionDate: 17-Jul-2002; LatestRevisionNote: Re-released for DXP Platform.; PackageReference: RAD-0.3; Publisher: Altium Limited; PackageDescription: Radial Cap, Thru-Hole; 2 Leads; 0.3 in Pin Spacing
P6 = HR911105A: RJ45插座
R5-R12 R46 R48 R50-R56 R58-R65 R67 R69 = Res2: Resistor; Published: 8-Jun-2000; LatestRevisionDate: 17-Jul-2002; LatestRevisionNote: Re-released for DXP Platform.; PackageReference: AXIAL-0.4; Publisher: Altium Limited; PackageDescription: Axial Device, Thru-Hole; 2 Leads; 0.4 in Pin Spacing
U12 = W5500: W5500以太网芯片
Y1 = XTAL: Crystal Oscillator; Published: 8-Jun-2000; LatestRevisionDate: 17-Jul-2002; LatestRevisionNote: Re-released for DXP Platform.; PackageReference: R38; Publisher: Altium Limited; PackageDescription: Crystal, Thru-Hole; 2 Leads; Body 3.1 x 8.2 mm (Dia.xH)

## Sheet POWER_SCH.SchDoc
size 431 x 279 mm
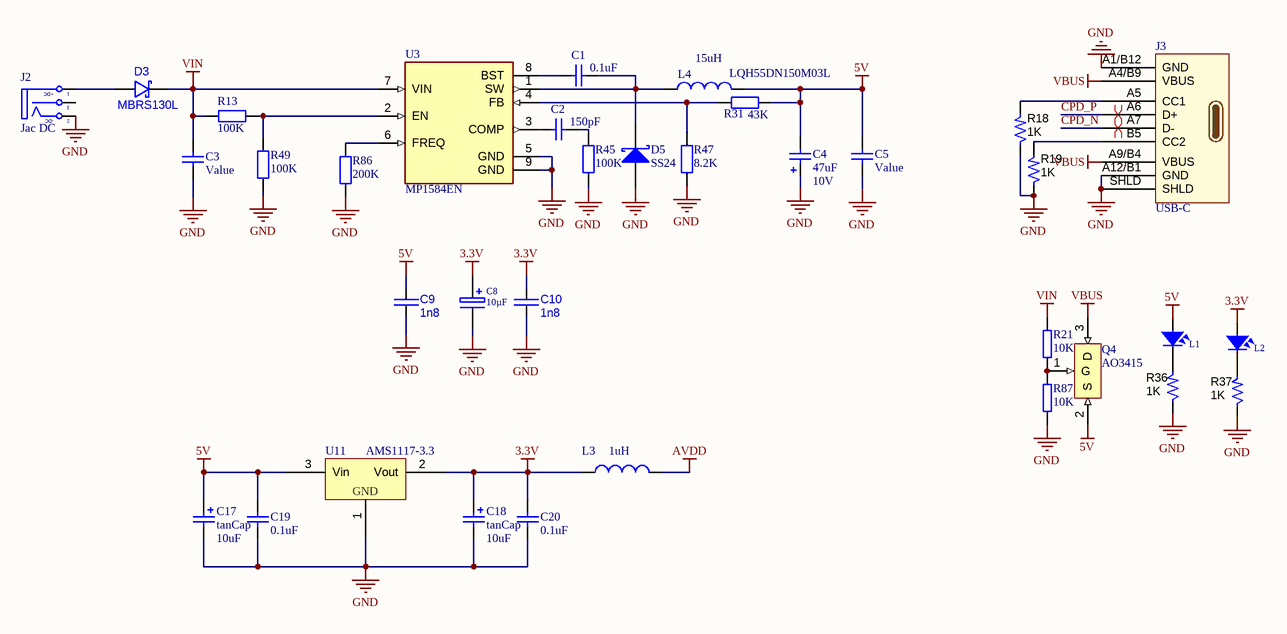
[diagram p4: POWER_SCH.SchDoc]

### Parts
C1  0.1uF  [CAP-0603]
C2  150pF  [CAP-0603]
C3  Value  [C1206]
C4  47uF  Voltage: 10V  [Tantal_B]
C5  Value  [C1206]
C8  CAP  [CAPMP3528X210N]  (value not drawn)
C9  value 1n8  [CAPC2012X135N]  (hidden comment: approved sub OK)
C10  value 1n8  [CAPC2012X135N]  (hidden comment: approved sub OK)
C17  tanCap  value 10uF  [C1206]
C18  tanCap  value 10uF  [C1206]
C19  value 0.1uF  [C0805]  (hidden comment: Cap)
C20  value 0.1uF  [C0805]  (hidden comment: Cap)
D3  MBRS130L  [DO-214AA]
D5  SS24  [SMB]
J2  Jac DC  [DC-IN]
J3  USB-C  [USB-C 8p]
L1  LED SMD  [SM-LED-0805-Orange]  (value not drawn)
L2  LED SMD  [SM-LED-0805-Orange]  (value not drawn)
L3  value 1uH  [C0805]  (hidden comment: Inductor)
L4  15uH  Marka: LQH55DN150M03L  [Inductor SMD 6.8*6.8*4.5]
Q4  AO3415  [SOT23-3]
R13  100K  [RES-0603]
R18  1K  [RESC1608N_ZERO]
R19  1K  [RESC1608N_ZERO]
R21  value 10K  [RESC1608N_ZERO]  (hidden comment: Resistor)
R31  43K  [RES-0603]
R36  1K  [RESC1608N_ZERO]
R37  1K  [RESC1608N_ZERO]
R45  100K  [RES-0603]
R47  8.2K  [RES-0603]
R49  100K  [RES-0603]
R86  200K  [RES-0603]
R87  value 10K  [RESC1608N_ZERO]  (hidden comment: Resistor)
U3  MP1584EN  [SOIC127P600X170-9N]
U11  AMS1117-3.3  [SOT223_M]

### Nets
3.3V: C8.1 C10.2 C18.1 C20.1 L2.1 L3.1 U11.2(Vout)
5V: C4.2 C5.2 C9.2 C17.1 C19.1 L1.1 L4.2 Q4.2(S) R31.2 U11.3(Vin)
AVDD: L3.2
GND: C3.1 C4.1 C5.1 C8.2 C9.1 C10.1 C17.2 C18.2 C19.2 C20.2 D5.1(A) J2.2(TN) J3.A1/B12(GND) J3.A12/B1(GND) J3.SHLD R18.1 R19.1 R36.1 R37.1 R45.2 R47.2 R49.1 R86.1 R87.2 U3.5(GND) U3.9(GND) U11.1(GND)
VBUS: J3.A4/B9(VBUS) J3.A9/B4(VBUS) Q4.3(D)
VIN: C3.2 D3.K R13.1 R21.1 U3.7(VIN)
CPD_N: J3.A7(D-)
CPD_P: J3.A6(D+)
NetC1_1: C1.1 U3.8(BST)
NetC1_2: C1.2 D5.2(K) L4.1 U3.1(SW)
NetC2_1: C2.1 U3.3(COMP)
NetC2_2: C2.2 R45.1
NetD3_A: D3.A J2.1(T)
NetJ3_A5: J3.A5(CC1) R18.2
NetJ3_B5: J3.B5(CC2) R19.2
NetL1_2: L1.2 R36.2
NetL2_2: L2.2 R37.2
NetQ4_1: Q4.1(G) R21.2 R87.1
NetR13_2: R13.2 R49.2 U3.2(EN)
NetR31_1: R31.1 R47.1 U3.4(FB)
NetR86_2: R86.2 U3.6(FREQ)

Not connected (* = marked no-connect by the designer): J2 3(S)

### Layout directives
differential pair: CPD_N, CPD_P

### Notes on the sheet
- DWG. NO.
- REV.
- SHT.
- THIS DOCUMENT AND THE DATA DISCLOSED HEREIN OR HEREWITH IS THE PROPERTY OF ALTIUM LIMITED AND MAY BE FREELY DISTRIBUTED IN WHOLE. NO RIGHTS ARE RESERVED OR EXPRESS OR IMPLIED WARANTEE GIVEN.
- REVISION
- DESCRIPTION
- DATE
- APPROVED
- ENG:
- APPROVALS
- PROJECT
- DSN:
- CHK:
- REFERENCE DOCUMENTS
- PROJECT REVISION:
- TITLE
- DOCUMENT REVISION:
- DESIGN ITEM:
- BOM:
- FAB DWG:
- PCB DWG:
- ASSY DWG:
- SCALE:
- SIZE
- B
- CAGE CODE
- FILE NAME
- DWG NO.
- SHEET
- OF
- REV
- (in symbol CAP Tatalium) 10µF
- (in symbol DCIN) +DC; -DC

### Library data of the parts
C1 C2 C19 C20 = Cap: Capacitor; Published: 8-Jun-2000; LatestRevisionDate: 17-Jul-2002; LatestRevisionNote: Re-released for DXP Platform.; PackageReference: RAD-0.3; Publisher: Altium Limited; PackageDescription: Radial Cap, Thru-Hole; 2 Leads; 0.3 in Pin Spacing
  C1 C2: price: price; links: links
C3 C5 = Cap SMD 1206
C4 = Cap Pol: Polarized Capacitor (Axial); Published: 8-Jun-2000; LatestRevisionDate: 17-Jul-2002; LatestRevisionNote: Re-released for DXP Platform.; PackageReference: POLAR0.8; Publisher: Altium Limited; PackageDescription: Polarized Capacitor; 2 Leads; links: https://www.promelec.ru/product/327656/; price: 12.53
C8 = CAP Tatalium
C9 C10 = CAP C_0805: as C6 on sheet Other_funtions; Tolerance: ±10%; Operating Temperature: -55°C ~ 125°C; Package / Case: 0805 (2012 metric); Supplier 1: Digi-Key; Supplier Part Number 1: 478-1374-1-ND
C17 C18 = Cap Pol2: Polarized Capacitor (Axial); Published: 8-Jun-2000; LatestRevisionDate: 17-Jul-2002; LatestRevisionNote: Re-released for DXP Platform.; PackageReference: POLAR0.8; Publisher: Altium Limited; PackageDescription: Polarized Capacitor; 2 Leads
D3 = DIODE_SCHOTTKY_MBRS130L: Diode Schottky SMD 30V 2A DO-214AA; Manufacturer 1: Fairchild Semiconductor; Material: Si; Ratings: 30Vr; 2A; SCDType: source; Package / Case: DO-214AA, SMB; Supplier 1: Digi-Key; Supplier Part Number 1: MBRS130LFSCT-ND; Manufacturer Part Number 1: MBRS130L
D5 = D Schottky: Schottky Diode; Published: 8-Jun-2000; LatestRevisionDate: 17-Jul-2002; LatestRevisionNote: Re-released for DXP Platform.; PackageReference: SMB; Publisher: Altium Limited; PackageDescription: DO-214-AA/SMB; 2 C-Bend Leads; Body 5.3 x 3.6 mm, inc. leads (LxW); Code_JEDEC: DO-214-AA
J2 = DCIN: Jac DC input; Value: Jac DC
L1 L2 = LED SMD 0805
L3 = Inductor: Code_IEC: 1005; Published: 8-Jun-2000; LatestRevisionDate: 29-May-2009; LatestRevisionNote: IPC-7351 Footprint Added.; PackageReference: 0402-A; Publisher: Altium Limited; PackageDescription: Chip Inductor; Code_JEITA: 0402
L4 = Inductor: price: 68.07; links: https://www.promelec.ru/product/318749/
R13 R31 R45 R47 R49 R86 = Res: price: price; links: links
R18 R19 R36 R37 = RES_0603: as R1 on sheet Other_funtions; Package / Case: 0603 (1608metric); Supplier 1: Digi-Key; Supplier Part Number 1: 541-0.0GCT-ND; ComponentLink1URL: http://www.vishay.com/doc?20035; ComponentLink1Description: http://www.vishay.com/doc?20035; Supplier 2: Digi-Key; Supplier Part Number 2: P0.0GTR-ND; Manufacturer 2: Panasonic Electronic Components; Manufacturer Part Number 2: ERJ-3GEY0R00V; RoHS 2: RoHS Compliant; ComponentLink2URL: http://industrial.panasonic.com/www-cgi/jvcr13pz.cgi?E+PZ+3+AOA0001+ERJ3GEY0R00V+7+WW; ComponentLink2Description: http://industrial.panasonic.com/www-cgi/jvcr13pz.cgi?E+PZ+3+AOA0001+ERJ3GEY0R00V+7+WW; Supplier 3: Digi-Key; Supplier Part Number 3: 311-0.0LECT-ND; Manufacturer 3: Yageo; Manufacturer Part Number 3: AC0603JR-070RL; RoHS 3: RoHS Compliant; ComponentLink3URL: http://www.yageo.com/documents/recent/PYu-AC_51_RoHS_L_2.pdf; ComponentLink3Description: http://www.yageo.com/documents/recent/PYu-AC_51_RoHS_L_2.pdf
R21 R87 = RES-SM-0603-10K: RES SM 0603 10K; Supplier 1: Farnell; Supplier 2: Digi-Key; Supplier Part Number 1: 9330399; Supplier Part Number 2: 541-10.0KHCT-ND
U3 = MP1584EN: Buck Switching Regulator IC Positive Adjustable 0.8V 1 Output 3A 8-SOIC _0.154, 3.90mm Width_ Exposed Pad; MF: Monolithic Power; MP: MP1584EN; Value: *; Package: SOIC-8 Monolithic Power; SnapEDA_Link: https://www.snapeda.com/parts/MP1584EN/Monolithic%20Power%20Systems%20Inc./view-part/891721/?ref=snap; Price: None; Availability: Unavailable
U11 = AMS1117: AMS1117-

## Sheet LEDS_DISP.SchDoc
size 431 x 279 mm
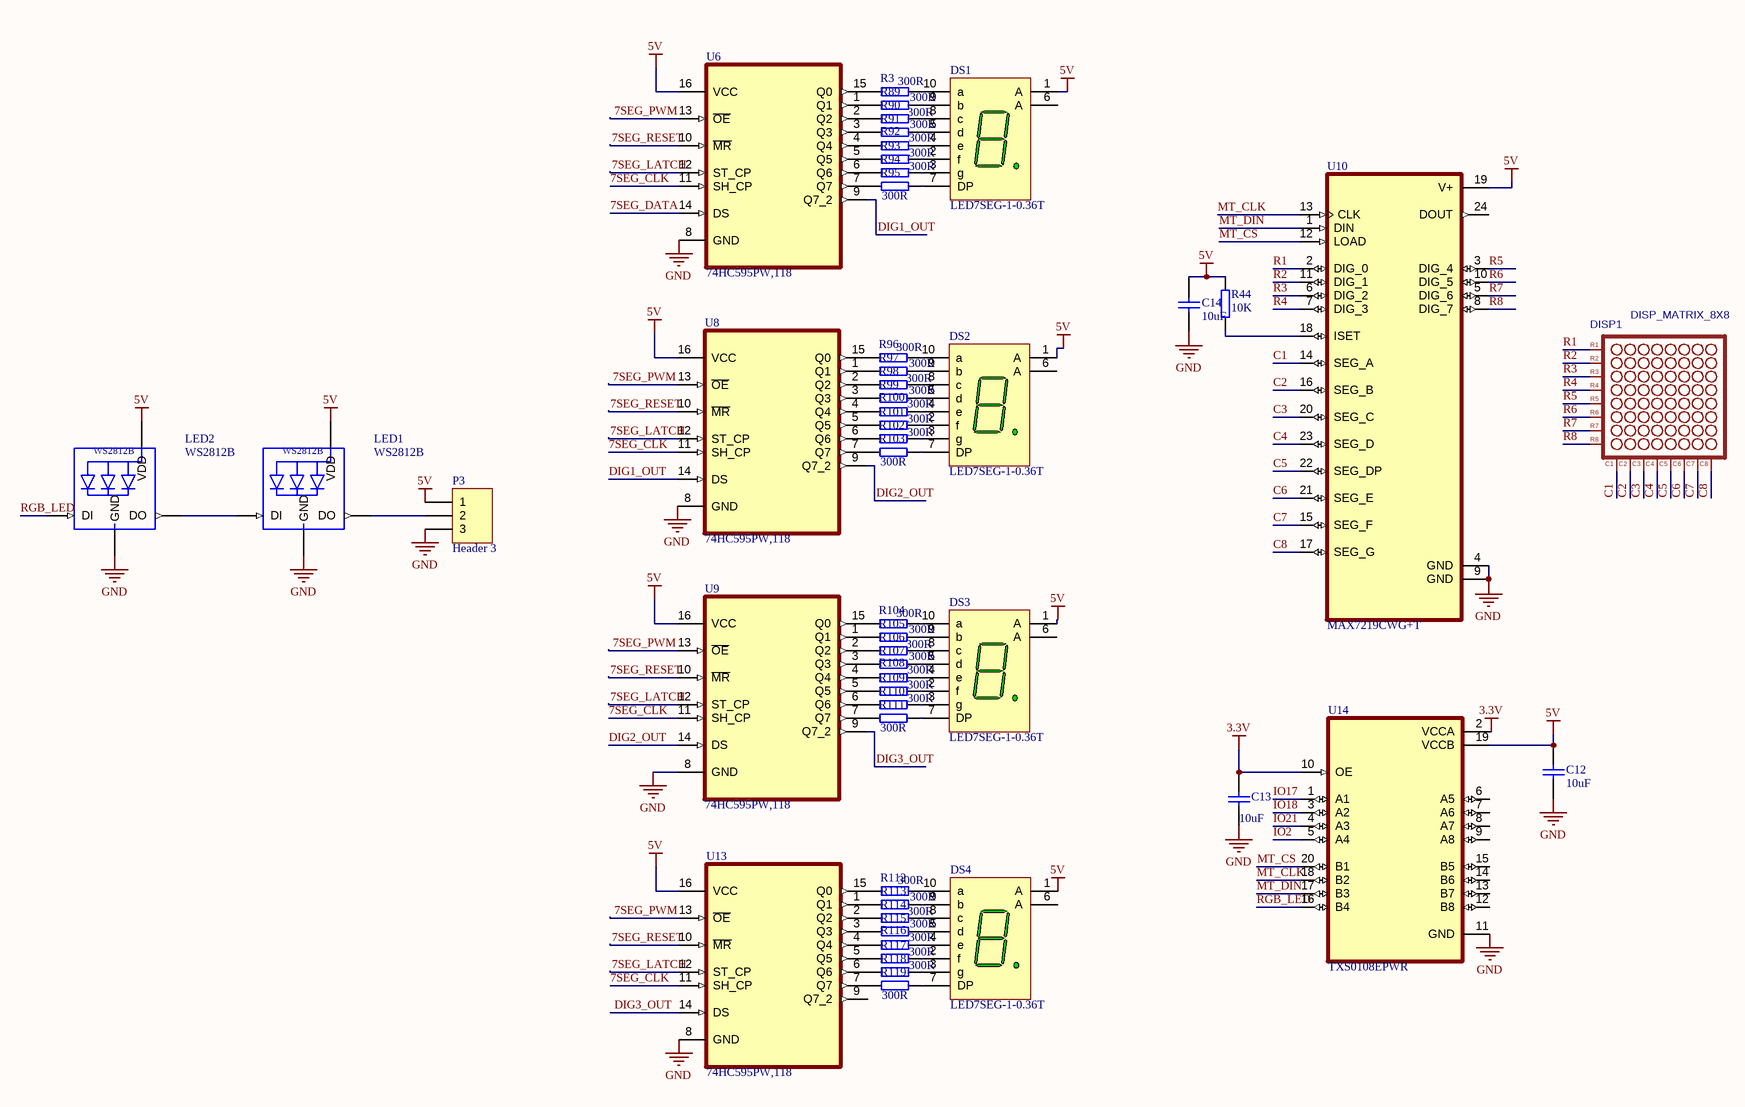
[diagram p5: LEDS_DISP.SchDoc]

### Parts
C12  value 10uF  [CAPC1608X90N]  (hidden comment: Cap Semi)
C13  value 10uF  [CAPC1608X90N]  (hidden comment: Cap Semi)
C14  value 10uF  [CAPC1608X90N]  (hidden comment: Cap Semi)
DISP1  DISP_MATRIX_8X8  [DISP_8X8_MATRIX_2020]
DS1  LED7SEG-1-0.36T  [LED7SEG-1-0.36T]
DS2  LED7SEG-1-0.36T  [LED7SEG-1-0.36T]
DS3  LED7SEG-1-0.36T  [LED7SEG-1-0.36T]
DS4  LED7SEG-1-0.36T  [LED7SEG-1-0.36T]
LED1  WS2812B  [WS2812B]
LED2  WS2812B  [WS2812B]
P3  Header 3  [HDR1X3]
R3  value 300R  [RESC1608N_ZERO]  (hidden comment: Resistor)
R44  value 10K  [RESC1608N_ZERO]  (hidden comment: Resistor)
R89  value 300R  [RESC1608N_ZERO]  (hidden comment: Resistor)
R90  value 300R  [RESC1608N_ZERO]  (hidden comment: Resistor)
R91  value 300R  [RESC1608N_ZERO]  (hidden comment: Resistor)
R92  value 300R  [RESC1608N_ZERO]  (hidden comment: Resistor)
R93  value 300R  [RESC1608N_ZERO]  (hidden comment: Resistor)
R94  value 300R  [RESC1608N_ZERO]  (hidden comment: Resistor)
R95  value 300R  [RESC1608N_ZERO]  (hidden comment: Resistor)
R96  value 300R  [RESC1608N_ZERO]  (hidden comment: Resistor)
R97  value 300R  [RESC1608N_ZERO]  (hidden comment: Resistor)
R98  value 300R  [RESC1608N_ZERO]  (hidden comment: Resistor)
R99  value 300R  [RESC1608N_ZERO]  (hidden comment: Resistor)
R100  value 300R  [RESC1608N_ZERO]  (hidden comment: Resistor)
R101  value 300R  [RESC1608N_ZERO]  (hidden comment: Resistor)
R102  value 300R  [RESC1608N_ZERO]  (hidden comment: Resistor)
R103  value 300R  [RESC1608N_ZERO]  (hidden comment: Resistor)
R104  value 300R  [RESC1608N_ZERO]  (hidden comment: Resistor)
R105  value 300R  [RESC1608N_ZERO]  (hidden comment: Resistor)
R106  value 300R  [RESC1608N_ZERO]  (hidden comment: Resistor)
R107  value 300R  [RESC1608N_ZERO]  (hidden comment: Resistor)
R108  value 300R  [RESC1608N_ZERO]  (hidden comment: Resistor)
R109  value 300R  [RESC1608N_ZERO]  (hidden comment: Resistor)
R110  value 300R  [RESC1608N_ZERO]  (hidden comment: Resistor)
R111  value 300R  [RESC1608N_ZERO]  (hidden comment: Resistor)
R112  value 300R  [RESC1608N_ZERO]  (hidden comment: Resistor)
R113  value 300R  [RESC1608N_ZERO]  (hidden comment: Resistor)
R114  value 300R  [RESC1608N_ZERO]  (hidden comment: Resistor)
R115  value 300R  [RESC1608N_ZERO]  (hidden comment: Resistor)
R116  value 300R  [RESC1608N_ZERO]  (hidden comment: Resistor)
R117  value 300R  [RESC1608N_ZERO]  (hidden comment: Resistor)
R118  value 300R  [RESC1608N_ZERO]  (hidden comment: Resistor)
R119  value 300R  [RESC1608N_ZERO]  (hidden comment: Resistor)
U6  74HC595PW,118  [SOP65P640X110-16N]
U8  74HC595PW,118  [SOP65P640X110-16N]
U9  74HC595PW,118  [SOP65P640X110-16N]
U10  MAX7219CWG+T  [SOIC127P1032X265-24N]
U13  74HC595PW,118  [SOP65P640X110-16N]
U14  TXS0108EPWR  [SOP65P640X120-20N]

### Nets
3.3V: C13.2 U14.2(VCCA) U14.10(OE)
5V: C12.1 C14.1 DS1.1(A) DS2.1(A) DS3.1(A) DS4.1(A) LED1.1-VDD(VDD) LED2.1-VDD(VDD) P3.1 R44.1 U6.16(VCC) U8.16(VCC) U9.16(VCC) U10.19(V+) U13.16(VCC) U14.19(VCCB)
GND: C12.2 C13.1 C14.2 LED1.3-GND(GND) LED2.3-GND(GND) P3.3 U6.8(GND) U8.8(GND) U9.8(GND) U10.4(GND) U10.9(GND) U13.8(GND) U14.11(GND)
7SEG_CLK: U6.11(SH_CP) U8.11(SH_CP) U9.11(SH_CP) U13.11(SH_CP)
7SEG_DATA: U6.14(DS)
7SEG_LATCH: U6.12(ST_CP) U8.12(ST_CP) U9.12(ST_CP) U13.12(ST_CP)
7SEG_PWM: U6.13(~{OE}) U8.13(~{OE}) U9.13(~{OE}) U13.13(~{OE})
7SEG_RESET: U6.10(~{MR}) U8.10(~{MR}) U9.10(~{MR}) U13.10(~{MR})
C1: DISP1.13(C1) U10.14(SEG_A)
C2: DISP1.3(C2) U10.16(SEG_B)
C3: DISP1.4(C3) U10.20(SEG_C)
C4: DISP1.10(C4) U10.23(SEG_D)
C5: DISP1.6(C5) U10.22(SEG_DP)
C6: DISP1.11(C6) U10.21(SEG_E)
C7: DISP1.15(C7) U10.15(SEG_F)
C8: DISP1.16(C8) U10.17(SEG_G)
DIG1_OUT: U6.9(Q7_2) U8.14(DS)
DIG2_OUT: U8.9(Q7_2) U9.14(DS)
DIG3_OUT: U9.9(Q7_2) U13.14(DS)
IO2: U14.5(A4)
IO17: U14.1(A1)
IO18: U14.3(A2)
IO21: U14.4(A3)
MT_CLK: U10.13(CLK) U14.18(B2)
MT_CS: U10.12(LOAD) U14.20(B1)
MT_DIN: U10.1(DIN) U14.17(B3)
R1: DISP1.9(R1) U10.2(DIG_0)
R2: DISP1.14(R2) U10.11(DIG_1)
R3: DISP1.8(R3) U10.6(DIG_2)
R4: DISP1.12(R4) U10.7(DIG_3)
R5: DISP1.1(R5) U10.3(DIG_4)
R6: DISP1.7(R6) U10.10(DIG_5)
R7: DISP1.2(R7) U10.5(DIG_6)
R8: DISP1.5(R8) U10.8(DIG_7)
RGB_LED: LED2.4-DIN(DI) U14.16(B4)
NetDS1_2: DS1.2(f) R93.1
NetDS1_3: DS1.3(g) R94.1
NetDS1_4: DS1.4(e) R92.1
NetDS1_5: DS1.5(d) R91.1
NetDS1_7: DS1.7(DP) R95.1
NetDS1_8: DS1.8(c) R90.1
NetDS1_9: DS1.9(b) R89.1
NetDS1_10: DS1.10(a) R3.1
NetDS2_2: DS2.2(f) R101.1
NetDS2_3: DS2.3(g) R102.1
NetDS2_4: DS2.4(e) R100.1
NetDS2_5: DS2.5(d) R99.1
NetDS2_7: DS2.7(DP) R103.1
NetDS2_8: DS2.8(c) R98.1
NetDS2_9: DS2.9(b) R97.1
NetDS2_10: DS2.10(a) R96.1
NetDS3_2: DS3.2(f) R109.1
NetDS3_3: DS3.3(g) R110.1
NetDS3_4: DS3.4(e) R108.1
NetDS3_5: DS3.5(d) R107.1
NetDS3_7: DS3.7(DP) R111.1
NetDS3_8: DS3.8(c) R106.1
NetDS3_9: DS3.9(b) R105.1
NetDS3_10: DS3.10(a) R104.1
NetDS4_2: DS4.2(f) R117.1
NetDS4_3: DS4.3(g) R118.1
NetDS4_4: DS4.4(e) R116.1
NetDS4_5: DS4.5(d) R115.1
NetDS4_7: DS4.7(DP) R119.1
NetDS4_8: DS4.8(c) R114.1
NetDS4_9: DS4.9(b) R113.1
NetDS4_10: DS4.10(a) R112.1
NetLED1_2-DOUT: LED1.2-DOUT(DO) P3.2
NetLED1_4-DIN: LED1.4-DIN(DI) LED2.2-DOUT(DO)
NetR3_2: R3.2 U6.15(Q0)
NetR44_2: R44.2 U10.18(ISET)
NetR89_2: R89.2 U6.1(Q1)
NetR90_2: R90.2 U6.2(Q2)
NetR91_2: R91.2 U6.3(Q3)
NetR92_2: R92.2 U6.4(Q4)
NetR93_2: R93.2 U6.5(Q5)
NetR94_2: R94.2 U6.6(Q6)
NetR95_2: R95.2 U6.7(Q7)
NetR96_2: R96.2 U8.15(Q0)
NetR97_2: R97.2 U8.1(Q1)
NetR98_2: R98.2 U8.2(Q2)
NetR99_2: R99.2 U8.3(Q3)
NetR100_2: R100.2 U8.4(Q4)
NetR101_2: R101.2 U8.5(Q5)
NetR102_2: R102.2 U8.6(Q6)
NetR103_2: R103.2 U8.7(Q7)
NetR104_2: R104.2 U9.15(Q0)
NetR105_2: R105.2 U9.1(Q1)
NetR106_2: R106.2 U9.2(Q2)
NetR107_2: R107.2 U9.3(Q3)
NetR108_2: R108.2 U9.4(Q4)
NetR109_2: R109.2 U9.5(Q5)
NetR110_2: R110.2 U9.6(Q6)
NetR111_2: R111.2 U9.7(Q7)
NetR112_2: R112.2 U13.15(Q0)
NetR113_2: R113.2 U13.1(Q1)
NetR114_2: R114.2 U13.2(Q2)
NetR115_2: R115.2 U13.3(Q3)
NetR116_2: R116.2 U13.4(Q4)
NetR117_2: R117.2 U13.5(Q5)
NetR118_2: R118.2 U13.6(Q6)
NetR119_2: R119.2 U13.7(Q7)

Not connected (* = marked no-connect by the designer): DS1 6(A); DS2 6(A); DS3 6(A); DS4 6(A); U10 24(DOUT); U13 9(Q7_2); U14 6(A5) 7(A6) 8(A7) 9(A8) 12(B8) 13(B7) 14(B6) 15(B5)

### Notes on the sheet
- DWG. NO.
- REV.
- SHT.
- THIS DOCUMENT AND THE DATA DISCLOSED HEREIN OR HEREWITH IS THE PROPERTY OF ALTIUM LIMITED AND MAY BE FREELY DISTRIBUTED IN WHOLE. NO RIGHTS ARE RESERVED OR EXPRESS OR IMPLIED WARANTEE GIVEN.
- REVISION
- DESCRIPTION
- DATE
- APPROVED
- ENG:
- APPROVALS
- PROJECT
- DSN:
- CHK:
- REFERENCE DOCUMENTS
- PROJECT REVISION:
- TITLE
- DOCUMENT REVISION:
- DESIGN ITEM:
- BOM:
- FAB DWG:
- PCB DWG:
- ASSY DWG:
- SCALE:
- SIZE
- B
- CAGE CODE
- FILE NAME
- DWG NO.
- SHEET
- OF
- REV

### Library data of the parts
C12-C14 = CAP-SM-0603-X5R-10uF: CAP SM 0603 X5R 10uF 10%; Tolerance: ±10%; Supplier 1: Farnell; Supplier 2: Digi-Key; Supplier Part Number 1: 2366833; Supplier Part Number 2: 490-3896-1-ND
DISP1 = DISP_MATRIX_8X8: catid: 20; Contributor: DangerousPrototype; BOM_Manufacturer Part: ?; spicePre: D
DS1-DS4 = LED7SEG-1-0.36T: 7.6 mm Micro Bright Green 7-Segment Display: CA, RH DP; Note: Pins 1 and 6 are redundant Anodes.; Published: 26-May-2004; LatestRevisionDate: 11-Oct-2004; LatestRevisionNote: Display outline superimposed on PCB Footprint.; DatasheetVersion: 11-Feb-2002; PackageVersion: 11-Feb-2002; PackageReference: A; Publisher: Altium Limited; PackageDescription: LED, 7-Segment Display, 7.62 mm, RHD; 10 Leads; Row Space 5.08 mm; Pitch 2.54 mm; ComponentLink1Description: Manufacturer Link; ComponentLink1URL: http://www.avagotech.com/; ComponentLink2Description: Datasheet; ComponentLink2URL: http://cp.literature.agilent.com/litweb/pdf/5988-4434EN.pdf
LED1 LED2 = WS2812B: Raspberry Pi HAT _40 pin_ Wheeled Robotics Kit; MF: SparkFun Electronics; Availability: Unavailable; SnapEDA_Link: https://www.snapeda.com/parts/WS2812B/Worldsemi/view-part/1038297/?ref=snap; MP: WS2812B; Price: None; Value: *; Package: None
P3 = Header 3: Header, 3-Pin; LatestRevisionDate: 17-Jul-2002; LatestRevisionNote: Re-released for DXP Platform.; Publisher: Altium Limited
R3 R89-R119 = RES-SM-0603-10K: RES SM 0603 300R; Supplier 1: Farnell; Supplier 2: Digi-Key; Supplier Part Number 1: 9330399; Supplier Part Number 2: 541-10.0KHCT-ND
R44 = RES-SM-0603-10K: RES SM 0603 10K; Supplier 1: Farnell; Supplier 2: Digi-Key; Supplier Part Number 1: 9330399; Supplier Part Number 2: 541-10.0KHCT-ND
U6 U8 U9 U13 = 74HC595PW,118: Shift Shift Register 1 Element 8 Bit 16-TSSOP; MF: Nexperia USA; SnapEDA_Link: https://www.snapeda.com/parts/74HC595PW,118/Nexperia/view-part/?ref=snap; Package: TSSOP16-16 Nexperia USA Inc.; Value: *; MP: 74HC595PW,118; Check_prices: https://www.snapeda.com/parts/74HC595PW,118/Nexperia/view-part/?ref=eda
U10 = MAX7219CWG+T: LED Driver 64 Segment 330000uA Supply Current 24-Pin SOIC W T/R; MF: Maxim Integrated Products; SnapEDA_Link: https://www.snapeda.com/parts/MAX7219CWG+T/Maxim+Integrated/view-part/?ref=snap; Package: None; Value: *; MP: MAX7219CWG+T; Check_prices: https://www.snapeda.com/parts/MAX7219CWG+T/Maxim+Integrated/view-part/?ref=eda
U14 = TXS0108EPWR: 8-bit bidirectional voltage-level shifter for open-drain and push-pull application; MF: Texas Instruments; Value: *; SnapEDA_Link: https://www.snapeda.com/parts/TXS0108EPWR/Texas+Instruments/view-part/?ref=snap; Purchase-URL: https://pricing.snapeda.com/search/part/TXS0108EPWR/?ref=eda; Availability: In Stock; Price: None; Package: TSSOP-20 Texas Instruments; Check_prices: https://www.snapeda.com/parts/TXS0108EPWR/Texas+Instruments/view-part/?ref=eda; MP: TXS0108EPWR

## Nets that join several sheets
3.3V: Other_funtions (19 pins), VGA (R85.1 U1.20 U4.20), ethernet (10 pins), POWER_SCH (7 pins), LEDS_DISP (C13.2 U14.2 U14.10)
5V: Other_funtions (8 pins), VGA (J1.9), POWER_SCH (10 pins), LEDS_DISP (16 pins)
AVDD: ethernet (11 pins), POWER_SCH (L3.2)
GND: Other_funtions (60 pins), VGA (15 pins), ethernet (25 pins), POWER_SCH (27 pins), LEDS_DISP (13 pins)
VBUS: Other_funtions (C7.2 C11.2 U5.8), POWER_SCH (J3.A4/B9 J3.A9/B4 Q4.3)
7SEG_CLK: Other_funtions (P1.6 U2.L17), VGA (U4.3), LEDS_DISP (U6.11 U8.11 U9.11 U13.11)
7SEG_DATA: Other_funtions (P1.27 U2.14), VGA (U4.6), LEDS_DISP (U6.14)
7SEG_LATCH: Other_funtions (P1.14 U2.L9 VT3.3), LEDS_DISP (U6.12 U8.12 U9.12 U13.12)
7SEG_PWM: Other_funtions (R120.1 S6.3), LEDS_DISP (U6.13 U8.13 U9.13 U13.13)
7SEG_RESET: Other_funtions (R32.2 S6.2), LEDS_DISP (U6.10 U8.10 U9.10 U13.10)
B_EN: Other_funtions (R26.1 S6.8), VGA (U1.19 U4.19)
CPD_N: Other_funtions (U5.5), POWER_SCH (J3.A7)
CPD_P: Other_funtions (U5.4), POWER_SCH (J3.A6)
IO1: Other_funtions (P1.2 U2.L21), VGA (J1.13)
IO2: Other_funtions (P1.1 U2.L22), VGA (J1.14), LEDS_DISP (U14.5)
IO3: Other_funtions (P1.24 S6.5 U2.10), VGA (U4.4)
IO4: Other_funtions (5 pins), VGA (U1.2)
IO5: Other_funtions (5 pins), VGA (U1.3)
IO6: Other_funtions (5 pins), VGA (U1.4)
IO7: Other_funtions (5 pins), VGA (U1.5)
IO8: Other_funtions (P1.33 U2.11), VGA (U1.6)
IO9: Other_funtions (P1.23 U2.8), ethernet (R11.1)
IO10: Other_funtions (P1.22 U2.7), ethernet (R12.1)
IO11: Other_funtions (J4.3 P1.21 U2.5), ethernet (R10.1)
IO12: Other_funtions (J4.7 P1.19 U2.L4), ethernet (R9.1)
IO13: Other_funtions (J4.5 P1.20 U2.L3), ethernet (R8.1)
IO14: Other_funtions (P1.17 U2.L6), ethernet (R7.1)
IO15: Other_funtions (P1.28 S6.7 U2.15), VGA (U4.5)
IO17: Other_funtions (P1.26 U2.13), VGA (U4.7), LEDS_DISP (U14.1)
IO18: Other_funtions (P1.25 U2.12), VGA (U4.8), LEDS_DISP (U14.3)
IO21: Other_funtions (P1.18 U2.L5), VGA (U4.9), LEDS_DISP (U14.4)
IO38: Other_funtions (P1.10 U2.L13), VGA (U1.7)
IO39: Other_funtions (P1.7 U2.L16), VGA (U1.8)
IO40: Other_funtions (P1.8 U2.L15), VGA (U1.9)
IO41: Other_funtions (P1.5 S6.6 U2.L18), VGA (U4.2)